# EAGLE design 3-con (EAGLE 5.06)
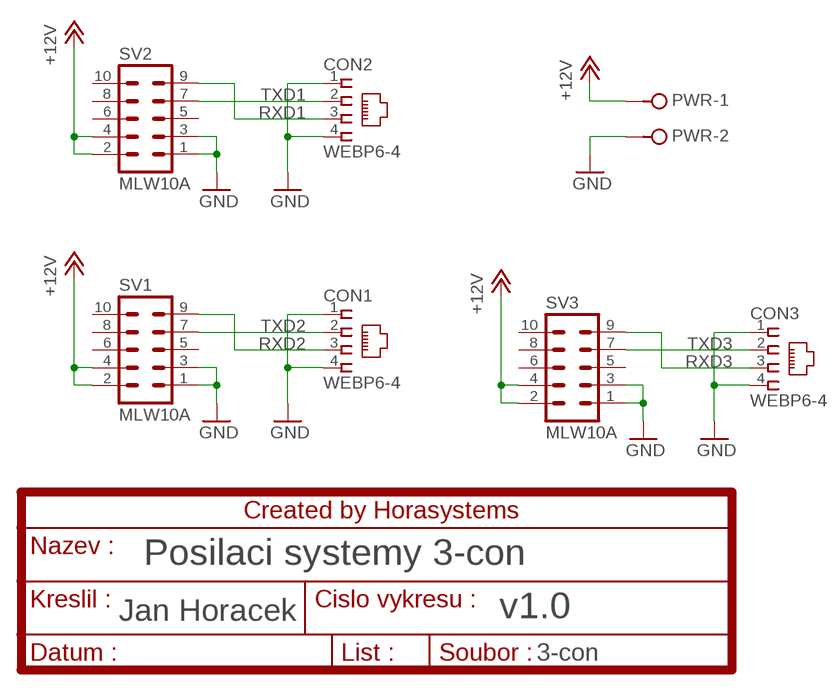
[diagram p0: schematic, sheet 1]

## Parts
CON1  WEBP6-4  [WEBP6-4]
CON2  WEBP6-4  [WEBP6-4]
CON3  WEBP6-4  [WEBP6-4]
PWR  ARK500/2  [ARK500/2]
SV1  MLW10A  ML10L  [ML10L]
SV2  MLW10A  ML10L  [ML10L]
SV3  MLW10A  ML10L  [ML10L]

## Nets
+12V: PWR.1 SV1.2 SV1.4 SV2.2 SV2.4 SV3.2 SV3.4
GND: CON1.1 CON1.4 CON2.1 CON2.4 CON3.1 CON3.4 PWR.2 SV1.1 SV1.3 SV2.1 SV2.3 SV3.1 SV3.3
RXD1: CON2.3 SV2.9
RXD2: CON1.3 SV1.9
RXD3: CON3.3 SV3.9
TXD1: CON2.2 SV2.7
TXD2: CON1.2 SV1.7
TXD3: CON3.2 SV3.7
Unconnected: SV1.5 SV1.6 SV1.8 SV1.10 SV2.5 SV2.6 SV2.8 SV2.10 SV3.5 SV3.6 SV3.8 SV3.10

## Notes on the sheet
- Posilaci systemy 3-con
- v1.0

## Library data of the parts
CON1-CON3 = con-malina:WEBP6-4
PWR = con-malina:ARK500/2
SV1-SV3 = con-ml:ML10L: HARTING

## Board
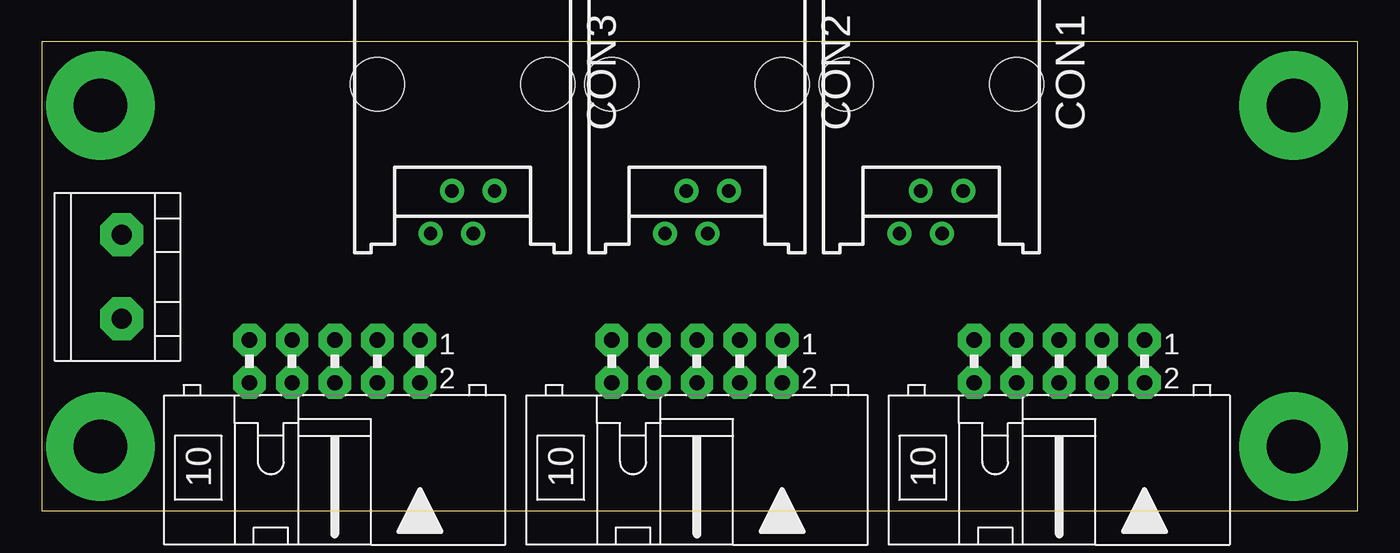
[diagram p1: board, top side]
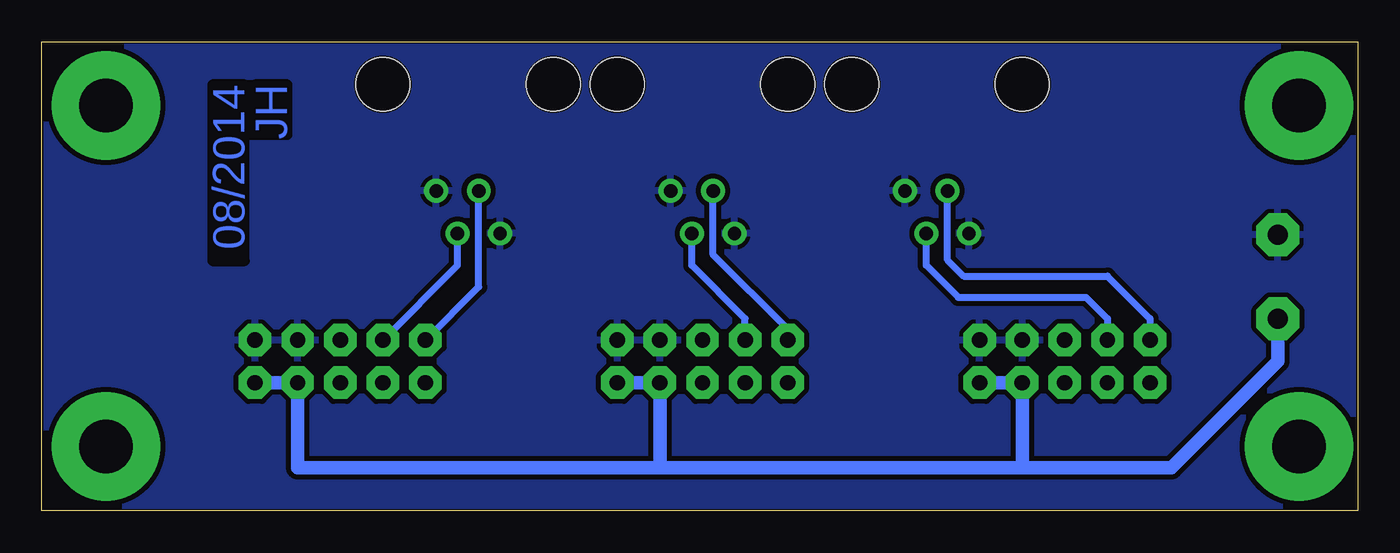
[diagram p2: board, bottom side, seen from below]

Size 78.41 x 27.92 mm. Coordinates in mm from the lower left corner, seen from the top.
Outline: 78.41,0 78.41,27.92 0,27.92 0,0 78.41,0
Copper layers (1*16): Top 0.036mm / dielectric 1.5011mm / Bottom 0.0356mm
Design rules "EBT_fotocesta_H": minimum track width 0.3mm, minimum drill 0.6mm, track to track 0.3mm, track to pad 0.3mm, pad to pad 0.2mm, via to via 0.2mm, smd to smd 0mil, copper to edge 0.1mm, drill to drill 0.5mm, minimum pad ring 0.3mm, minimum via ring 0.4mm, stop-mask expansion 0mil, vias tented up to drill 0mil, thermal gap 10mil

### Footprints (pad centres in the part's own frame; a part is rotated, then mirrored left to right if it is on the bottom)
WEBP6-4 = drill 0.8 pad 1.422 round: 1 -1.905,6.35; 2 -0.635,8.89; 3 0.635,6.35; 4 1.905,8.89 | hole 3.2: -5.08,0; 5.08,0
ARK500/2 = drill 1.2 pad 2.54 octagon: 1 0,0; 2 5,0
ML10L = drill 0.914 pad 1.93 octagon: 1 -5.08,-1.27; 2 -5.08,1.27; 3 -2.54,-1.27; 4 -2.54,1.27; 5 0,-1.27; 6 0,1.27; 7 2.54,-1.27; 8 2.54,1.27; 9 5.08,-1.27; 10 5.08,1.27

### Placement (x,y rotation side)
CON1  53.01,25.4 180 top
CON2  39.04,25.4 180 top
CON3  25.07,25.4 180 top
PWR  4.75,11.43 90 top
SV1  60.63,8.89 180 top
SV2  39.04,8.89 180 top
SV3  17.45,8.89 180 top

### Tracks (layer width: path | path; a pad name or v marks a point on that pad's centre or on a via)
+12V
  Bottom 0.813: PWR.1 4.75,8.89 11.1,2.54 19.99,2.54 | 41.58,2.54 63.17,2.54 SV1.4 SV1.2 | 41.58,2.54 19.99,2.54 | SV2.2 SV2.4 41.58,2.54 | SV3.2 SV3.4 19.99,2.54
GND
  pour Bottom: 78.41,0 -0.33,0 -0.33,27.94 78.41,27.94
N$1  (via drill 3.2 pad 6.45)
  other vias: 74.6,3.81
N$2  (via drill 3.2 pad 6.45)
  other vias: 74.6,24.13
N$3  (via drill 3.2 pad 6.45)
  other vias: 3.48,24.13
N$4  (via drill 3.2 pad 6.45)
  other vias: 3.48,3.81
RXD1
  Bottom 0.406: CON2.3 38.4,15.24 33.96,10.79 SV2.9
RXD2
  Bottom 0.406: CON1.3 52.38,13.34 SV1.9
RXD3
  Bottom 0.406: SV3.9 12.37,11.43 14.91,13.97 23.48,13.97 24.44,14.92 CON3.3
TXD1
  Bottom 0.406: CON2.2 39.68,14.61 36.5,11.43 SV2.7
TXD2
  Bottom 0.406: CON1.2 53.64,14.61 SV1.7
TXD3
  Bottom 0.406: CON3.2 25.71,14.61 23.8,12.7 16.18,12.7 14.91,11.43 SV3.7

### Text on the board
Bottom: JH | 08/2014